# EAGLE design relayinput4 (EAGLE 9.3.2)

## Sheet 1 of 2
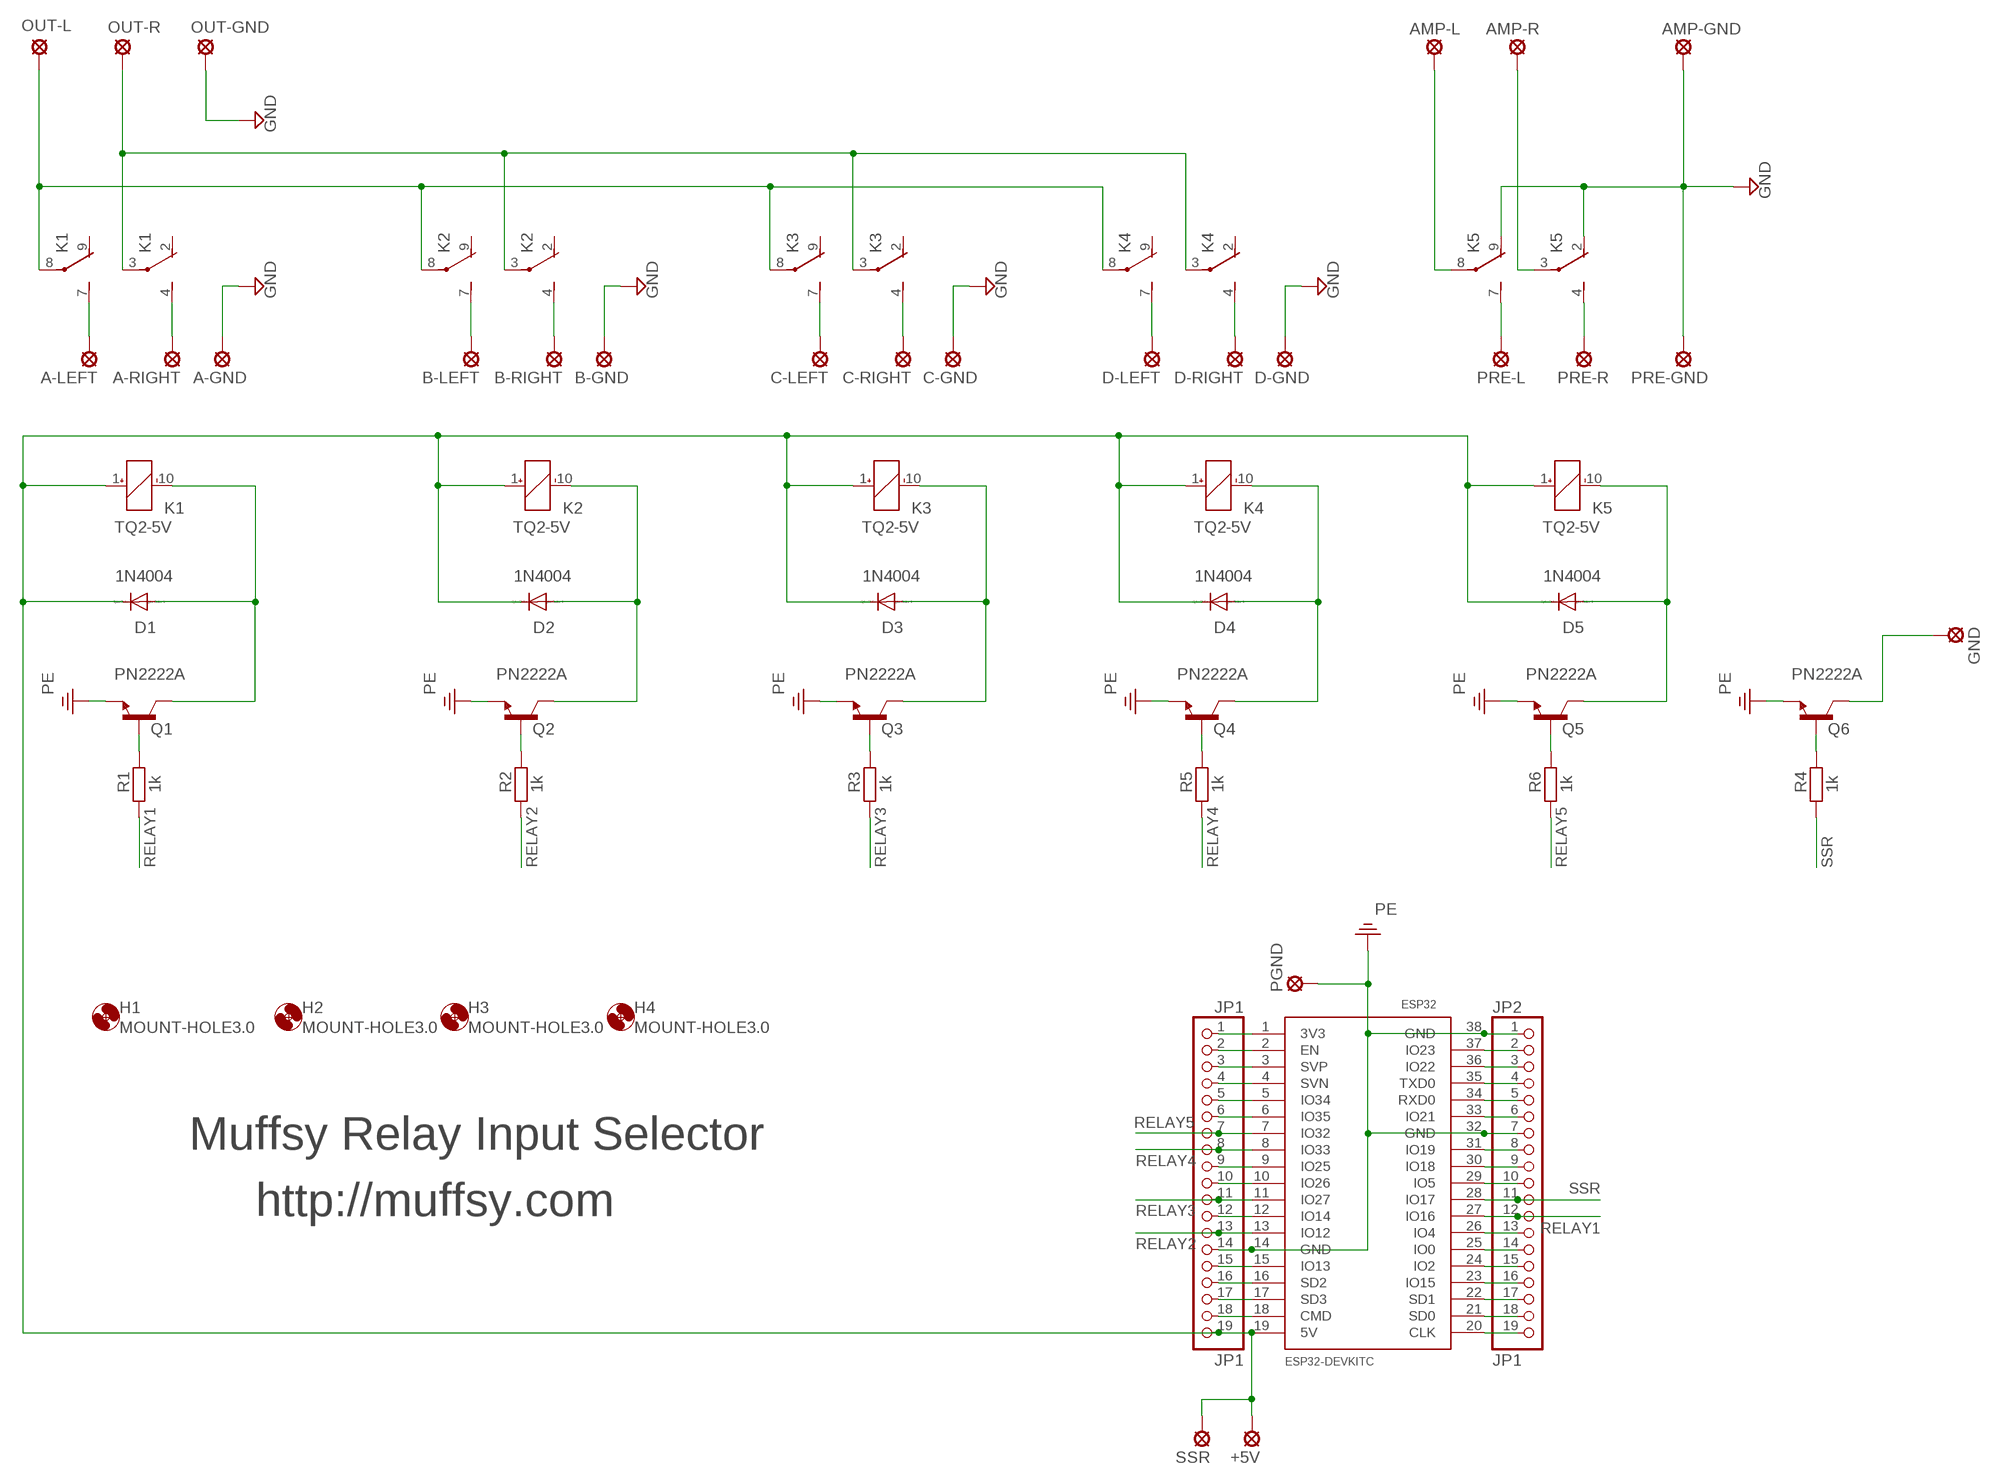
[diagram p0: schematic, sheet 1]

### Parts
+5V  SE11  [SE11]
A-GND  SE11  [SE11]
A-LEFT  SE11  [SE11]
A-RIGHT  SE11  [SE11]
AMP-GND  SE11  [SE11]
AMP-L  SE11  [SE11]
AMP-R  SE11  [SE11]
B-GND  SE11  [SE11]
B-LEFT  SE11  [SE11]
B-RIGHT  SE11  [SE11]
C-GND  SE11  [SE11]
C-LEFT  SE11  [SE11]
C-RIGHT  SE11  [SE11]
D1  1N4004  [DO41-10]
D2  1N4004  [DO41-10]
D3  1N4004  [DO41-10]
D4  1N4004  [DO41-10]
D5  1N4004  [DO41-10]
D-GND  SE11  [SE11]
D-LEFT  SE11  [SE11]
D-RIGHT  SE11  [SE11]
ESP32  ESP32DEVKITC  [ESP32-DEVKITC]
GND  SE11  [SE11]
H1  MOUNT-HOLE3.0  [3,0]
H2  MOUNT-HOLE3.0  [3,0]
H3  MOUNT-HOLE3.0  [3,0]
H4  MOUNT-HOLE3.0  [3,0]
JP1  JP1  PINHD-1X19  [1X19]
JP2  JP1  PINHD-1X19  [1X19]
K1  TQ2-5V  TQ2-12V  [TQ2]
K2  TQ2-5V  TQ2-12V  [TQ2]
K3  TQ2-5V  TQ2-12V  [TQ2]
K4  TQ2-5V  TQ2-12V  [TQ2]
K5  TQ2-5V  TQ2-12V  [TQ2]
OUT-GND  SE11  [SE11]
OUT-L  SE11  [SE11]
OUT-R  SE11  [SE11]
PGND  SE11  [SE11]
PRE-GND  SE11  [SE11]
PRE-L  SE11  [SE11]
PRE-R  SE11  [SE11]
Q1  PN2222A  [TO92]
Q2  PN2222A  [TO92]
Q3  PN2222A  [TO92]
Q4  PN2222A  [TO92]
Q5  PN2222A  [TO92]
Q6  PN2222A  [TO92]
R1  1k  R-EU_0207/10  [0207/10]
R2  1k  R-EU_0207/10  [0207/10]
R3  1k  R-EU_0207/10  [0207/10]
R4  1k  R-EU_0207/10  [0207/10]
R5  1k  R-EU_0207/10  [0207/10]
R6  1k  R-EU_0207/10  [0207/10]
SSR  SE11  [SE11]

### Nets
GND: A-GND.MP AMP-GND.MP B-GND.MP C-GND.MP D-GND.MP K5.2(1:O) K5.9(2:O) OUT-GND.MP PRE-GND.MP
N$1: B-LEFT.MP K2.7(2:S)
N$2: A-LEFT.MP K1.7(2:S)
N$3: A-RIGHT.MP K1.4(1:S)
N$4: B-RIGHT.MP K2.4(1:S)
N$5: C-LEFT.MP K3.7(2:S)
N$6: C-RIGHT.MP K3.4(1:S)
N$7: D-LEFT.MP K4.7(2:S)
N$8: D-RIGHT.MP K4.4(1:S)
N$9: K5.7(2:S) PRE-L.MP
N$10: K5.4(1:S) PRE-R.MP
N$11: Q1.B R1.2
N$12: K1.3(1:P) K2.3(1:P) K3.3(1:P) K4.3(1:P) OUT-R.MP
N$13: K1.8(2:P) K2.8(2:P) K3.8(2:P) K4.8(2:P) OUT-L.MP
N$14: Q2.B R2.2
N$15: +5V.MP D1.C D2.C D3.C D4.C D5.C ESP32.19(5V) JP1.19 K1.1(_:+) K2.1(_:+) K3.1(_:+) K4.1(_:+) K5.1(_:+) SSR.MP
N$16: Q3.B R3.2
N$17: Q4.B R5.2
N$18: Q5.B R6.2
N$19: ESP32.1(3V3) JP1.1
N$20: D1.A K1.10(_:-) Q1.C
N$21: D2.A K2.10(_:-) Q2.C
N$22: D3.A K3.10(_:-) Q3.C
N$23: D4.A K4.10(_:-) Q4.C
N$24: D5.A K5.10(_:-) Q5.C
N$25: ESP32.2(EN) JP1.2
N$26: ESP32.3(SVP) JP1.3
N$27: ESP32.4(SVN) JP1.4
N$28: ESP32.5(IO34) JP1.5
N$29: ESP32.6(IO35) JP1.6
N$30: AMP-R.MP K5.3(1:P)
N$31: AMP-L.MP K5.8(2:P)
N$33: ESP32.10(IO26) JP1.10
N$35: ESP32.12(IO14) JP1.12
N$36: ESP32.9(IO25) JP1.9
N$37: GND.MP Q6.C
N$38: ESP32.15(IO13) JP1.15
N$39: Q6.B R4.2
N$40: ESP32.29(IO5) JP2.10
N$43: ESP32.36(IO22) JP2.3
N$44: ESP32.16(SD2) JP1.16
N$45: ESP32.17(SD3) JP1.17
N$46: ESP32.18(CMD) JP1.18
N$49: ESP32.37(IO23) JP2.2
N$51: ESP32.35(TXD0) JP2.4
N$52: ESP32.34(RXD0) JP2.5
N$53: ESP32.33(IO21) JP2.6
N$55: ESP32.31(IO19) JP2.8
N$56: ESP32.30(IO18) JP2.9
N$60: ESP32.26(IO4) JP2.13
N$61: ESP32.25(IO0) JP2.14
N$62: ESP32.24(IO2) JP2.15
N$63: ESP32.23(IO15) JP2.16
N$64: ESP32.22(SD1) JP2.17
N$65: ESP32.21(SD0) JP2.18
N$66: ESP32.20(CLK) JP2.19
PE: ESP32.14(GND) ESP32.32(GND) ESP32.38(GND) JP1.14 JP2.1 JP2.7 PGND.MP Q1.E Q2.E Q3.E Q4.E Q5.E Q6.E
RELAY1: ESP32.27(IO16) JP2.12 R1.1
RELAY2: ESP32.13(IO12) JP1.13 R2.1
RELAY3: ESP32.11(IO27) JP1.11 R3.1
RELAY4: ESP32.8(IO33) JP1.8 R5.1
RELAY5: ESP32.7(IO32) JP1.7 R6.1
SSR: ESP32.28(IO17) JP2.11 R4.1
Unconnected: K1.2(1:O) K1.9(2:O) K2.2(1:O) K2.9(2:O) K3.2(1:O) K3.9(2:O) K4.2(1:O) K4.9(2:O)

### Notes on the sheet
- Muffsy Relay Input Selector
- http://muffsy.com

## Sheet 2 of 2

## Library data of the parts
+5V A-GND A-LEFT A-RIGHT AMP-GND AMP-L AMP-R B-GND B-LEFT B-RIGHT C-GND C-LEFT C-RIGHT D-GND D-LEFT D-RIGHT GND OUT-GND OUT-L OUT-R PGND PRE-GND PRE-L PRE-R SSR = relswitch:SE11: SOLDER PAD RTM, drill 1,1mm, distributor Buerklin, 07F810
D1-D5 = relswitch:1N4004: DIODE general purpose rectifier, 1 A
ESP32 = ESP32-DEVKITC:ESP32DEVKITC
H1-H4 = relswitch:MOUNT-HOLE: MOUNTING HOLE with drill center marker
JP1 JP2 = relswitch:PINHD-1X19: PIN HEADER
K1-K5 = relswitch:TQ2?*: LOW PROFILE 2 FORM C RELAY NAiS Source: http://www.mew-europe.com/.. en_ds_61020_0001.pdf Source: http://www.mew-europe.com/.. en_ds_61020_0004.pdf; MF: AROMAT/ MATSUSHITA; MPN: TQ2-12V; OC_FARNELL: 1200949; OC_NEWARK: 64K3197
Q1-Q6 = PN2222A-user:PN2222A: General Purpose NPN Transistor; AVAILABILITY: Unavailable; MF: STMicroelectronics; MP: PN2222A; PACKAGE: TO-92 Rectron; PRICE: None
R1-R6 = relswitch:R-EU_: RESISTOR, European symbol

## Board
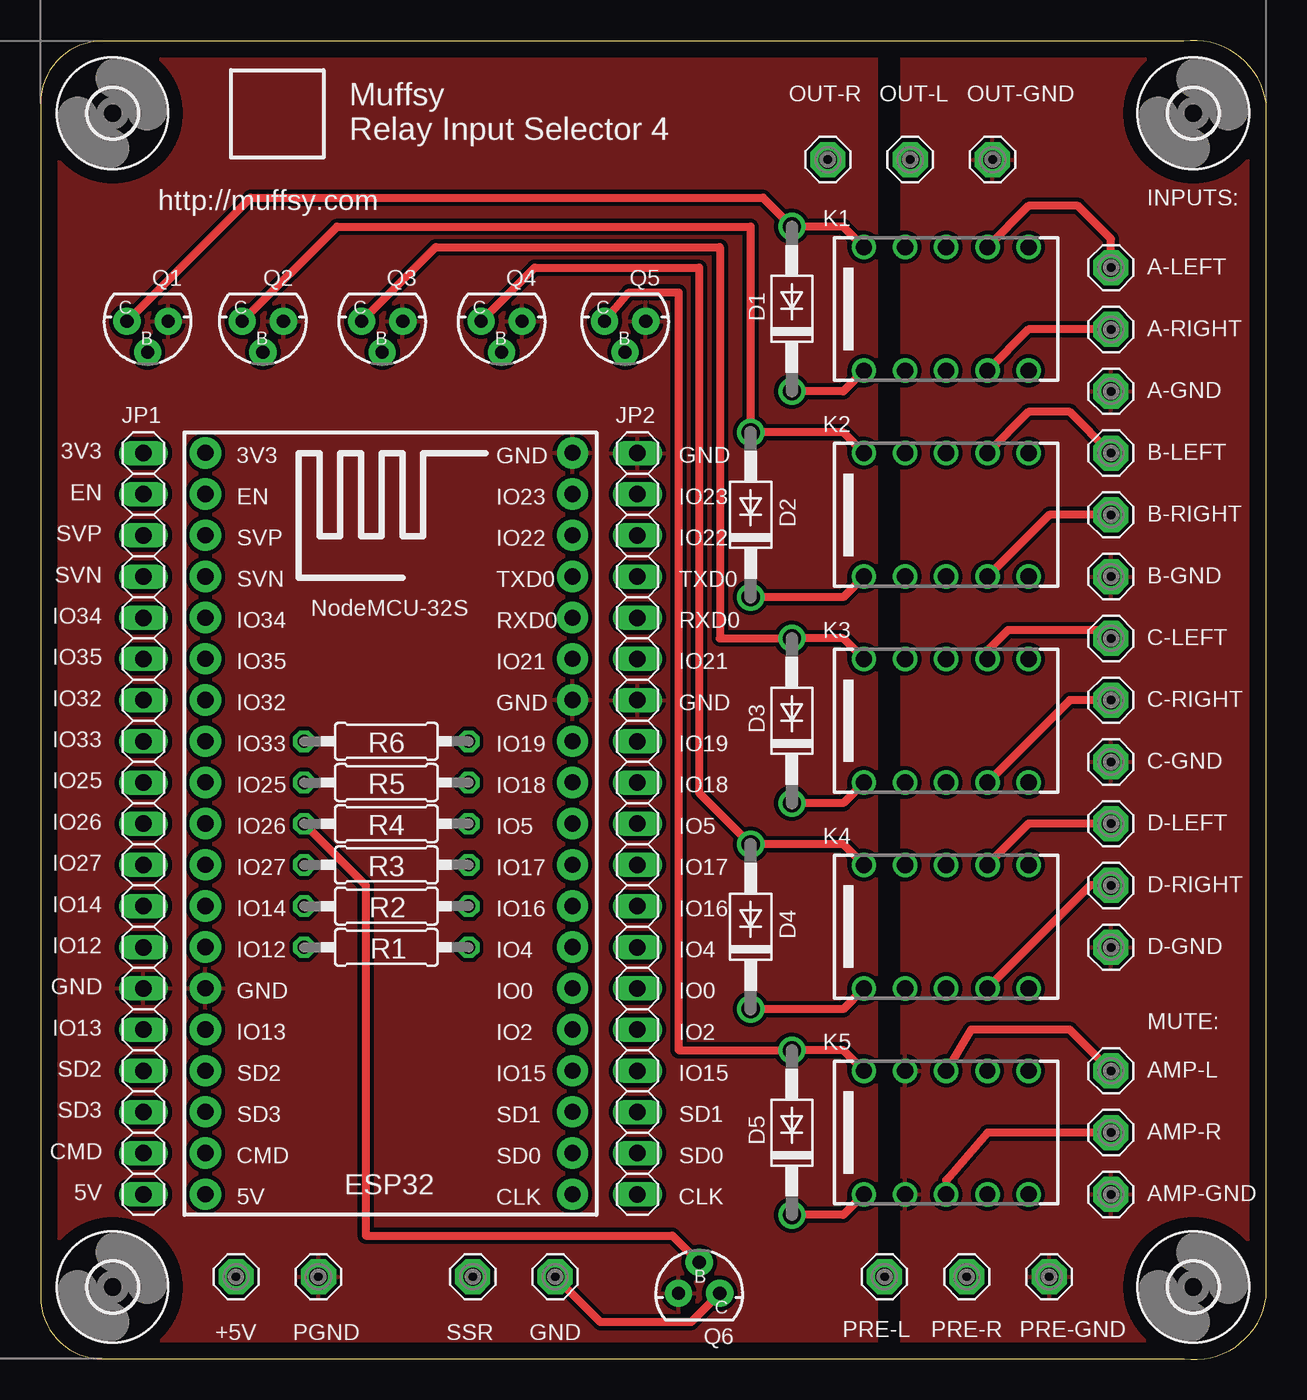
[diagram p1: board, top side]
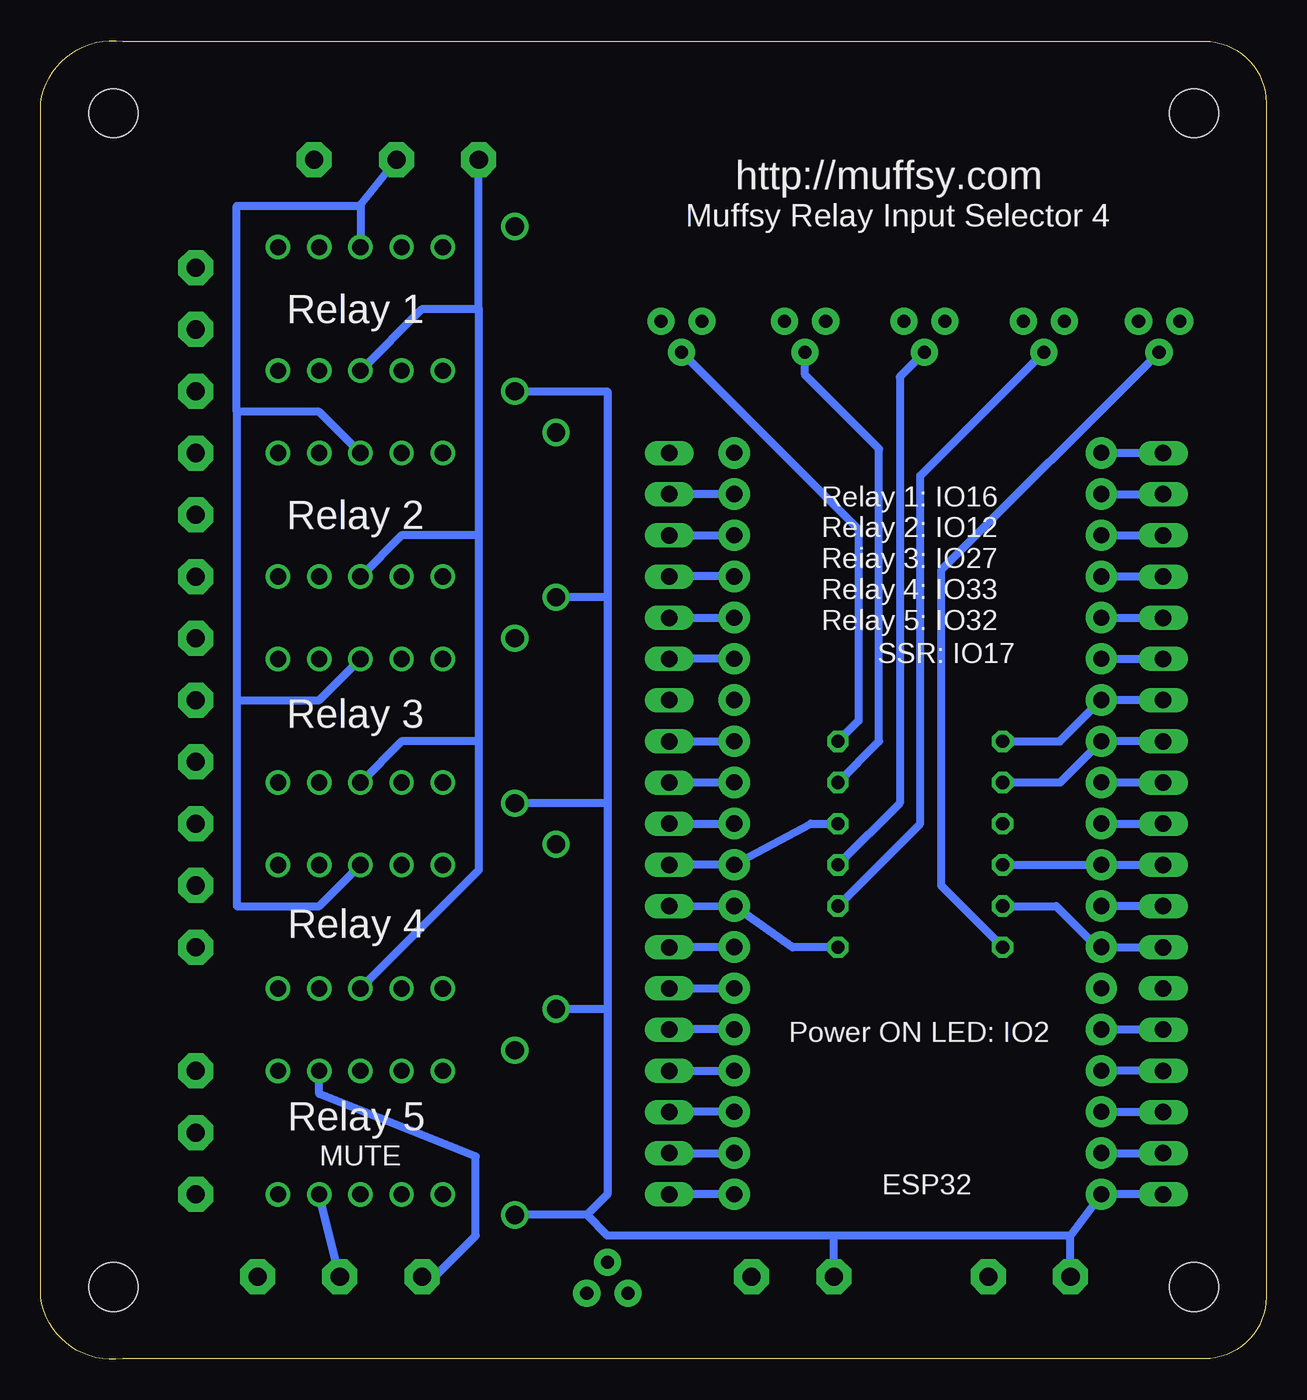
[diagram p2: board, bottom side, seen from below]

Size 75.62 x 81.34 mm. Coordinates in mm from the lower left corner, seen from the top.
Outline: 75.62,3.83 75.62,77.49 arc90 70.54,81.3 3.81,81.3 arc90 0,77.49 0,3.85 arc90 3.81,0.04 70.56,0.04 arc90 75.62,3.83
Copper layers (1*16): Top 0.035mm / dielectric 1.5mm / Bottom 0.035mm
Design rules "default": minimum track width 6mil, minimum drill 0.35mm, track to track 6mil, track to pad 6mil, pad to pad 6mil, via to via 6mil, smd to smd 6mil, copper to edge 40mil, drill to drill 6mil, minimum pad ring 10mil, minimum via ring 8mil, stop-mask expansion 4mil, vias tented up to drill 0mil, thermal gap 10mil

### Footprints (pad centres in the part's own frame; a part is rotated, then mirrored left to right if it is on the bottom)
SE11 = drill 1.118 pad 2.159 octagon: MP 0,0
DO41-10 = drill 1.118: A 5.08,0; C -5.08,0
ESP32-DEVKITC = drill 1 pad 1.93: 1 -22.87,-11.42; 2 -20.33,-11.42; 3 -17.79,-11.42; 4 -15.25,-11.42; 5 -12.71,-11.42; 6 -10.17,-11.42; 7 -7.63,-11.42; 8 -5.09,-11.42; 9 -2.55,-11.42; 10 -0.01,-11.42; 11 2.53,-11.42; 12 5.07,-11.42; 13 7.61,-11.42; 14 10.15,-11.42; 15 12.69,-11.42; 16 15.23,-11.42; 17 17.77,-11.42; 18 20.31,-11.42; 19 22.85,-11.42; 20 22.85,11.23; 21 20.31,11.23; 22 17.77,11.23; 23 15.23,11.23; 24 12.69,11.23; 25 10.15,11.23; 26 7.61,11.23; 27 5.07,11.23; 28 2.53,11.23; 29 -0.01,11.23; 30 -2.55,11.23; 31 -5.09,11.23; 32 -7.63,11.23; 33 -10.17,11.23; 34 -12.71,11.23; 35 -15.25,11.23; 36 -17.79,11.23; 37 -20.33,11.23; 38 -22.87,11.23
3,0 = hole 3: 0,0
1X19 = drill 1.016 long: 1 -22.86,0; 2 -20.32,0; 3 -17.78,0; 4 -15.24,0; 5 -12.7,0; 6 -10.16,0; 7 -7.62,0; 8 -5.08,0; 9 -2.54,0; 10 0,0; 11 2.54,0; 12 5.08,0; 13 7.62,0; 14 10.16,0; 15 12.7,0; 16 15.24,0; 17 17.78,0; 18 20.32,0; 19 22.86,0
TQ2 = drill 1: 1 -5.08,-3.81; 2 -2.54,-3.81; 3 0,-3.81; 4 2.54,-3.81; 5 5.08,-3.81; 6 5.08,3.81; 7 2.54,3.81; 8 0,3.81; 9 -2.54,3.81; 10 -5.08,3.81
TO92 = drill 0.813 pad 1.676: B 0,1.905; C 1.27,0; E -1.27,0
0207/10 = drill 0.813 octagon: 1 -5.08,0; 2 5.08,0

### Placement (x,y rotation side)
+5V  12.07,5.1 180 top
A-GND  66.04,59.71 0 top
A-LEFT  66.04,67.33 0 top
A-RIGHT  66.04,63.52 0 top
AMP-GND  66.04,10.18 0 top
AMP-L  66.04,17.8 0 top
AMP-R  66.04,13.99 0 top
B-GND  66.04,48.28 0 top
B-LEFT  66.04,55.9 0 top
B-RIGHT  66.04,52.09 0 top
C-GND  66.04,36.85 0 top
C-LEFT  66.04,44.47 0 top
C-RIGHT  66.04,40.66 0 top
D1  46.36,64.79 90 top
D2  43.82,52.09 90 top
D3  46.36,39.39 90 top
D4  43.82,26.69 90 top
D5  46.36,13.99 90 top
D-GND  66.04,25.42 0 top
D-LEFT  66.04,33.04 0 top
D-RIGHT  66.04,29.23 0 top
ESP32  21.59,33.04 270 top
GND  31.75,5.1 0 top
H1  71.12,4.47 0 top
H2  4.45,4.47 0 top
H3  71.12,76.86 0 top
H4  4.45,76.86 0 top
JP1  6.35,33.04 270 top
JP2  36.83,33.04 270 top
K1  55.88,64.79 0 top
K2  55.88,52.09 0 top
K3  55.88,39.39 0 top
K4  55.88,26.69 0 top
K5  55.88,13.99 0 top
OUT-GND  58.74,74 270 top
OUT-L  53.66,74 270 top
OUT-R  48.58,74 270 top
PGND  17.14,5.1 270 top
PRE-GND  62.23,5.1 90 top
PRE-L  52.07,5.1 90 top
PRE-R  57.15,5.1 90 top
Q1  6.6,64.03 180 top
Q2  13.72,64.03 180 top
Q3  21.08,64.03 180 top
Q4  28.45,64.03 180 top
Q5  36.07,64.03 180 top
Q6  40.64,4.09 0 top
R1  21.34,25.42 180 top
R2  21.34,27.96 0 top
R3  21.34,30.5 0 top
R4  21.34,33.04 180 top
R5  21.34,35.58 0 top
R6  21.34,38.12 0 top
SSR  26.67,5.1 0 top

### Tracks (layer width: path | path; a pad name or v marks a point on that pad's centre or on a via)
GND
  pour Top (isolate 0.254): 75.56,0.02 75.56,81.3 53.15,81.3 53.15,0.02
N$1
  Top 0.508: B-LEFT.MP 63.5,58.44 60.96,58.44 K2.7
N$2
  Top 0.508: A-LEFT.MP 66.04,69.11 64.01,71.14 60.96,71.14 K1.7
N$3
  Top 0.508: A-RIGHT.MP 60.96,63.52 K1.4
N$4
  Top 0.508: B-RIGHT.MP 62.23,52.09 K2.4
N$5
  Top 0.508: C-LEFT.MP 65.53,44.98 59.69,44.98 58.42,43.71 K3.7
N$6
  Top 0.508: C-RIGHT.MP 63.5,40.66 K3.4
N$7
  Top 0.508: D-LEFT.MP 60.96,33.04 K4.7
N$8
  Top 0.508: D-RIGHT.MP 64.77,29.23 K4.4
N$9
  Bottom 0.508: PRE-L.MP 51.31,5.1 48.77,7.64 48.77,12.52 58.42,16.38 K5.7
N$10
  Bottom 0.508: PRE-R.MP K5.4
N$11
  Bottom 0.508: R1.2 20.07,29.23 20.07,48.66 Q1.B
N$12
  Bottom 0.508: 48.58,64.79 48.58,50.82 | 48.58,50.82 48.58,38.12 | 48.58,64.79 OUT-R.MP | 48.58,38.12 48.58,30.18 K4.3 | 48.58,38.12 53.34,38.12 K3.3 | 48.58,50.82 53.34,50.82 K2.3 | K1.3 52.07,64.79 48.58,64.79
N$13
  Bottom 0.508: 55.94,71.14 63.5,71.14 63.5,58.44 | K1.8 55.88,71.14 55.94,71.14 | 63.5,58.44 63.5,40.66 | 63.5,40.66 63.5,27.96 58.42,27.96 K4.8 | OUT-L.MP 55.94,71.14 | 63.5,40.66 58.42,40.66 K3.8 | K2.8 58.42,58.44 63.5,58.44
N$14
  Bottom 0.508: Q2.B 21.34,54.5 21.34,33.04 R2.2
N$15
  Top 0.508: K5.1 49.53,8.91 D5.C | K4.1 49.53,21.61 D4.C | K3.1 49.53,34.31 D3.C | K2.1 49.53,47.01 D2.C | K1.1 49.53,59.71 D1.C
  Bottom 0.508: 40.64,47.01 D2.C | 40.64,34.31 D3.C | 41.91,8.91 D5.C | 40.64,47.01 40.64,59.71 D1.C | 40.64,47.01 40.64,34.31 | 40.64,34.31 40.64,21.61 | 40.64,21.61 D4.C | ESP32.19 | 12.07,7.64 ESP32.19 | +5V.MP 12.07,7.64 | SSR.MP 26.67,7.64 | 12.07,7.64 26.67,7.64 | JP1.19 ESP32.19 | 40.64,21.61 40.64,10.18 41.91,8.91 | 26.67,7.64 40.64,7.64 41.91,8.91
N$16
  Bottom 0.508: Q3.B 22.61,60.6 22.61,34.31 R3.2
N$17
  Bottom 0.508: Q4.B 28.45,60.73 23.88,56.16 23.88,38.12 R5.2
N$18
  Bottom 0.508: R6.2 25.15,39.39 25.15,51.2 Q5.B
N$19
  Bottom 0.508: ESP32.1 6.36,55.91 JP1.1
N$20
  Top 0.508: Q1.C 12.95,71.65 44.58,71.65 D1.A 49.53,69.87 K1.10
N$21
  Top 0.508: Q2.C 18.29,69.87 43.82,69.87 D2.A 49.53,57.17 K2.10
N$22
  Top 0.508: Q3.C 24.38,68.6 41.91,68.6 41.91,44.47 D3.A 49.53,44.47 K3.10
N$23
  Top 0.508: Q4.C 30.48,67.33 40.64,67.33 40.64,34.95 D4.A 49.53,31.77 K4.10
N$24
  Top 0.508: K5.10 49.53,19.07 D5.A 39.37,19.07 39.37,65.81 36.32,65.81 Q5.C
N$25
  Bottom 0.508: ESP32.2 6.36,53.37 JP1.2
N$26
  Bottom 0.508: ESP32.3 6.36,50.83 JP1.3
N$27
  Bottom 0.508: ESP32.4 6.36,48.29 JP1.4
N$28
  Bottom 0.508: ESP32.5 6.36,45.75 JP1.5
N$29
  Bottom 0.508: ESP32.6 6.36,43.21 JP1.6
N$30
  Top 0.508: AMP-R.MP 58.42,13.99 55.88,11.06 K5.3
N$31
  Top 0.508: AMP-L.MP 63.5,20.34 57.4,20.34 K5.8
N$33
  Bottom 0.508: ESP32.10 6.36,33.05 JP1.10
N$35
  Bottom 0.508: ESP32.12 6.36,27.97 JP1.12
N$36
  Bottom 0.508: ESP32.9 6.36,35.59 JP1.9
N$37
  Top 0.508: Q6.C 40.13,2.31 34.54,2.31 GND.MP
N$38
  Bottom 0.508: ESP32.15 6.36,20.35 JP1.15
N$39
  Top 0.508: R4.2 20.07,29.23 20.07,7.64 38.99,7.64 Q6.B
N$40
  Bottom 0.508: JP2.10 33.02,33.04 33.01,33.05 ESP32.29
N$43
  Bottom 0.508: JP2.3 33.02,50.82 33.01,50.83 ESP32.36
N$44
  Bottom 0.508: JP1.16 ESP32.16
N$45
  Bottom 0.508: ESP32.17 6.36,15.27 JP1.17
N$46
  Bottom 0.508: ESP32.18 6.36,12.73 JP1.18
N$49
  Bottom 0.508: ESP32.37 32.83,53.36 JP2.2
N$51
  Bottom 0.508: ESP32.35 JP2.4
N$52
  Bottom 0.508: ESP32.34 32.83,45.74 JP2.5
N$53
  Bottom 0.508: ESP32.33 32.83,43.2 JP2.6
N$55
  Bottom 0.508: JP2.8 ESP32.31
N$56
  Bottom 0.508: ESP32.30 32.83,35.58 JP2.9
N$60
  Bottom 0.508: ESP32.26 JP2.13
N$61
  Bottom 0.508: JP2.14 32.83,22.88 ESP32.25
N$62
  Bottom 0.508: ESP32.24 JP2.15
N$63
  Bottom 0.508: JP2.16 33.02,17.8 33.01,17.81 ESP32.23
N$64
  Bottom 0.508: ESP32.22 JP2.17
N$65
  Bottom 0.508: JP2.18 32.83,12.72 ESP32.21
N$66
  Bottom 0.508: ESP32.20 JP2.19
PE
  pour Top (isolate 0.254, rank 5): 0,81.3 0,0.02 51.56,0.02 51.56,81.3
RELAY1
  Bottom 0.508: R1.1 29.21,25.42 ESP32.27 JP2.12
RELAY2
  Bottom 0.508: JP1.13 6.36,25.43 ESP32.13 10.42,25.43 12.95,27.96 R2.1
RELAY3
  Bottom 0.508: JP1.11 6.36,30.51 ESP32.11 R3.1
RELAY4
  Bottom 0.508: JP1.8 ESP32.8 12.72,35.58 R5.1
RELAY5
  Bottom 0.508: JP1.7 6.36,40.67 ESP32.7 12.72,38.12 R6.1
SSR
  Bottom 0.508: JP2.11 ESP32.28 28.09,33.04 R4.1

### Text on the board
tNames: Muffsy / Relay Input Selector 4 | http://muffsy.com | INPUTS: | 3V3 / EN / SVP / SVN / IO34 / IO35 / IO32 / IO33 / IO25 / IO26 / IO27 / IO14 / IO12 / GND / IO13 / SD2 / SD3 / CMD / 5V | MUTE: | GND / IO23 / IO22 / TXD0 / RXD0 / IO21 / GND / IO19 / IO18 / IO5 / IO17 / IO16 / IO4 / IO0 / IO2 / IO15 / SD1 / SD0 / CLK
bNames: http://muffsy.com | Muffsy Relay Input Selector 4 | Relay 1 | Relay 2 | Relay 1: IO16 / Relay 2: IO12 / Reiay 3: IO27 / Relay 4: IO33 / Relay 5: IO32 | SSR: IO17 | Relay 3 | Relay 4 | Power ON LED: IO2 | Relay 5 | MUTE | ESP32